# Altium schematic sheet 12-RTL8111H-3.schdoc
size A2
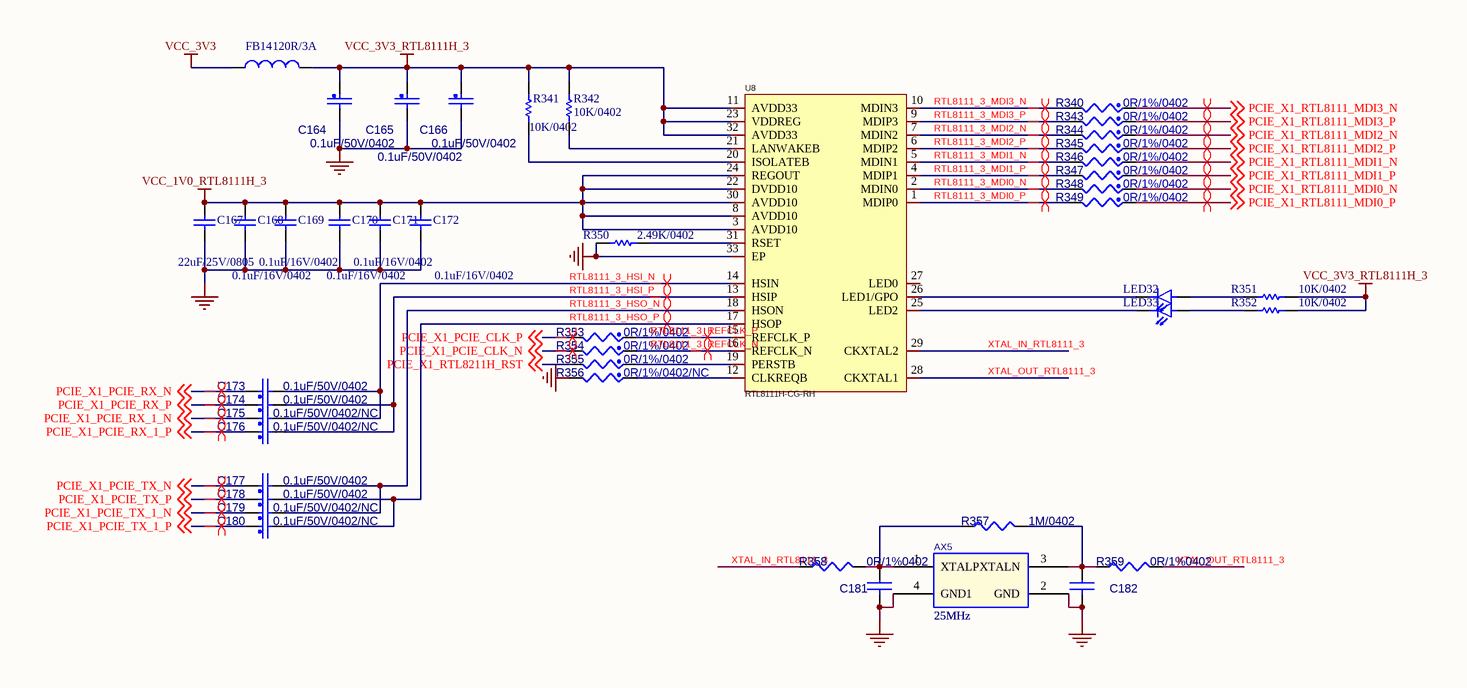
[diagram p0: 12-RTL8111H-3.schdoc]

## Parts
AX5  25MHz  [2016]
C164  value 0.1uF/50V/0402  [C0402]  (hidden comment: CAP_NP)
C165  value 0.1uF/50V/0402  [C0402]  (hidden comment: CAP_NP)
C166  value 0.1uF/50V/0402  [C0402]  (hidden comment: CAP_NP)
C167  22uF/25V/0805  [C0805]
C168  0.1uF/16V/0402  [C0402]
C169  0.1uF/16V/0402  [C0402]
C170  0.1uF/16V/0402  [C0402]
C171  0.1uF/16V/0402  [C0402]
C172  0.1uF/16V/0402  [C0402]
C173  value 0.1uF/50V/0402  [C0402]  (hidden comment: CAP_NP)
C174  value 0.1uF/50V/0402  [C0402]  (hidden comment: CAP_NP)
C175  value 0.1uF/50V/0402/NC  [C0402]  (hidden comment: CAP_NP)
C176  value 0.1uF/50V/0402/NC  [C0402]  (hidden comment: CAP_NP)
C177  value 0.1uF/50V/0402  [C0402]  (hidden comment: CAP_NP)
C178  value 0.1uF/50V/0402  [C0402]  (hidden comment: CAP_NP)
C179  value 0.1uF/50V/0402/NC  [C0402]  (hidden comment: CAP_NP)
C180  value 0.1uF/50V/0402/NC  [C0402]  (hidden comment: CAP_NP)
C181  CAP NP_Dup3  [C0402]  (value not drawn)
C182  CAP NP_Dup3  [C0402]  (value not drawn)
FB14  120R/3A  [L0603]
LED32  LED_GREEN  [LED0603]  (value not drawn)
LED33  LED_GREEN  [LED0603]  (value not drawn)
R340  value 0R/1%/0402  [R0402]  (hidden comment: RES_Dup2)
R341  10K/0402  [R0402]
R342  10K/0402  [R0402]
R343  value 0R/1%/0402  [R0402]  (hidden comment: RES_Dup2)
R344  value 0R/1%/0402  [R0402]  (hidden comment: RES_Dup2)
R345  value 0R/1%/0402  [R0402]  (hidden comment: RES_Dup2)
R346  value 0R/1%/0402  [R0402]  (hidden comment: RES_Dup2)
R347  value 0R/1%/0402  [R0402]  (hidden comment: RES_Dup2)
R348  value 0R/1%/0402  [R0402]  (hidden comment: RES_Dup2)
R349  value 0R/1%/0402  [R0402]  (hidden comment: RES_Dup2)
R350  2.49K/0402  [R0402]
R351  10K/0402  [R0402]
R352  10K/0402  [R0402]
R353  value 0R/1%/0402  [R0402]  (hidden comment: RES_Dup2)
R354  value 0R/1%/0402  [R0402]  (hidden comment: RES_Dup2)
R355  value 0R/1%/0402  [R0402]  (hidden comment: RES_Dup2)
R356  value 0R/1%/0402/NC  [R0402]  (hidden comment: RES_Dup2)
R357  value 1M/0402  [R0402]  (hidden comment: R_Dup3)
R358  value 0R/1%0402  [R0402]  (hidden comment: R_Dup3)
R359  value 0R/1%0402  [R0402]  (hidden comment: R_Dup3)
U8  RTL8111H-CG-RH  [RTL8111H-CG-RH]

## Nets
GND: AX5.2(GND) AX5.4(GND1) C164.2 C165.2 C166.2 C167.1 C168.1 C169.1 C170.1 C171.1 C172.1 C181.2 C182.2 R350.1 R356.2 U8.33(EP)
VCC_1V0_RTL8111H_3: C167.2 C168.2 C169.2 C170.2 C171.2 C172.2 U8.3(AVDD10) U8.8(AVDD10) U8.22(DVDD10) U8.24(REGOUT) U8.30(AVDD10)
VCC_3V3: FB14.1
VCC_3V3_RTL8111H_3: C164.1 C165.1 C166.1 FB14.2 R341.1 R342.1 R351.1 R352.1 U8.11(AVDD33) U8.23(VDDREG) U8.32(AVDD33)
PCIE_X1_PCIE_CLK_N: R354.2 ; off-sheet PCIE_X1_PCIE_CLK_N
PCIE_X1_PCIE_CLK_P: R353.2 ; off-sheet PCIE_X1_PCIE_CLK_P
PCIE_X1_PCIE_RX_1_N: C175.1 ; off-sheet PCIE_X1_PCIE_RX_1_N
PCIE_X1_PCIE_RX_1_P: C176.1 ; off-sheet PCIE_X1_PCIE_RX_1_P
PCIE_X1_PCIE_RX_N: C173.1 ; off-sheet PCIE_X1_PCIE_RX_N
PCIE_X1_PCIE_RX_P: C174.1 ; off-sheet PCIE_X1_PCIE_RX_P
PCIE_X1_PCIE_TX_1_N: C179.1 ; off-sheet PCIE_X1_PCIE_TX_1_N
PCIE_X1_PCIE_TX_1_P: C180.1 ; off-sheet PCIE_X1_PCIE_TX_1_P
PCIE_X1_PCIE_TX_N: C177.1 ; off-sheet PCIE_X1_PCIE_TX_N
PCIE_X1_PCIE_TX_P: C178.1 ; off-sheet PCIE_X1_PCIE_TX_P
PCIE_X1_RTL8111_MDI0_N: R348.1 ; off-sheet PCIE_X1_RTL8111_MDI0_N
PCIE_X1_RTL8111_MDI0_P: R349.1 ; off-sheet PCIE_X1_RTL8111_MDI0_P
PCIE_X1_RTL8111_MDI1_N: R346.1 ; off-sheet PCIE_X1_RTL8111_MDI1_N
PCIE_X1_RTL8111_MDI1_P: R347.1 ; off-sheet PCIE_X1_RTL8111_MDI1_P
PCIE_X1_RTL8111_MDI2_N: R344.1 ; off-sheet PCIE_X1_RTL8111_MDI2_N
PCIE_X1_RTL8111_MDI2_P: R345.1 ; off-sheet PCIE_X1_RTL8111_MDI2_P
PCIE_X1_RTL8111_MDI3_N: R340.1 ; off-sheet PCIE_X1_RTL8111_MDI3_N
PCIE_X1_RTL8111_MDI3_P: R343.1 ; off-sheet PCIE_X1_RTL8111_MDI3_P
PCIE_X1_RTL8211H_RST: R355.2 ; off-sheet PCIE_X1_RTL8211H_RST
RTL8111_3_HSI_N: C173.2 C175.2 U8.14(HSIN)
RTL8111_3_HSI_P: C174.2 C176.2 U8.13(HSIP)
RTL8111_3_HSO_N: C177.2 C179.2 U8.18(HSON)
RTL8111_3_HSO_P: C178.2 C180.2 U8.17(HSOP)
RTL8111_3_MDI0_N: R348.2 U8.2(MDIN0)
RTL8111_3_MDI0_P: R349.2 U8.1(MDIP0)
RTL8111_3_MDI1_N: R346.2 U8.5(MDIN1)
RTL8111_3_MDI1_P: R347.2 U8.4(MDIP1)
RTL8111_3_MDI2_N: R344.2 U8.7(MDIN2)
RTL8111_3_MDI2_P: R345.2 U8.6(MDIP2)
RTL8111_3_MDI3_N: R340.2 U8.10(MDIN3)
RTL8111_3_MDI3_P: R343.2 U8.9(MDIP3)
RTL8111_3_REFCLK_N: R354.1 U8.16(REFCLK_N)
RTL8111_3_REFCLK_P: R353.1 U8.15(REFCLK_P)
XTAL_IN_RTL8111_3: R358.1 U8.29(CKXTAL2)
XTAL_OUT_RTL8111_3: R359.2 U8.28(CKXTAL1)
NetAX5_1: AX5.1(XTALP) C181.1 R357.1 R358.2
NetAX5_3: AX5.3(XTALN) C182.1 R357.2 R359.1
NetLED32_1: LED32.1 R351.2
NetLED32_2: LED32.2 U8.26(LED1/GPO)
NetLED33_1: LED33.1 R352.2
NetLED33_2: LED33.2 U8.25(LED2)
NetR341_2: R341.2 U8.20(ISOLATEB)
NetR342_2: R342.2 U8.21(LANWAKEB)
NetR350_2: R350.2 U8.31(RSET)
NetR355_1: R355.1 U8.19(PERSTB)
NetR356_1: R356.1 U8.12(CLKREQB)

Not connected (* = marked no-connect by the designer): U8 27(LED0)

## Layout directives
differential pair: PCIE_X1_PCIE_CLK_N, PCIE_X1_PCIE_CLK_P, PCIE_X1_PCIE_RX_1_N, PCIE_X1_PCIE_RX_1_P, PCIE_X1_PCIE_RX_N, PCIE_X1_PCIE_RX_P, PCIE_X1_PCIE_TX_1_N, PCIE_X1_PCIE_TX_1_P, PCIE_X1_PCIE_TX_N, PCIE_X1_PCIE_TX_P, PCIE_X1_RTL8111_MDI0_N, PCIE_X1_RTL8111_MDI0_P, PCIE_X1_RTL8111_MDI1_N, PCIE_X1_RTL8111_MDI1_P, PCIE_X1_RTL8111_MDI2_N, PCIE_X1_RTL8111_MDI2_P, PCIE_X1_RTL8111_MDI3_N, PCIE_X1_RTL8111_MDI3_P, RTL8111_3_HSI_N, RTL8111_3_HSI_P, RTL8111_3_HSO_N, RTL8111_3_HSO_P, RTL8111_3_MDI0_N, RTL8111_3_MDI0_P, RTL8111_3_MDI1_N, RTL8111_3_MDI1_P, RTL8111_3_MDI2_N, RTL8111_3_MDI2_P, RTL8111_3_MDI3_N, RTL8111_3_MDI3_P, RTL8111_3_REFCLK_N, RTL8111_3_REFCLK_P

## Library data of the parts
AX5 = XTAL_0: Part Reference: AX3; PCB Footprint: CRY5032; Value: 25MHz
C164-C166 C173-C180 = CAP_NP: GCM155R71H104KE02/MURATA; Part Reference: C15; CLASS: DISCRETE; FPLIST: CC0402_25,CC0402_HD,CC0402_CC; CAD_APPROVED: Yes; MFG_PN01: 0402YC104KAT2A; MFG_NAME01: AVX; Tolerance: 10%; AGILE_PN: 150-75182; VOLTAGE: 16V; HEIGHT: 0.635MM; ROHS: Yes; TOL: 10%; PCB Footprint: C0402
C167-C172 = CAP: Capacitor; Value: 100pF; Published: 8-Jun-2000; Revision: July-2002: Re-released for DXP Platform.; Publisher: Altium Limited
C181 = CAP NP_Dup3: Part Reference: C71; Value: 20pF/50V X7R; PCB Footprint: C0402
C182 = CAP NP_Dup3: Part Reference: C72; Value: 20pF/50V X7R; PCB Footprint: C0402
FB14 = Inductor: BLM18KG121TN1D; Code_IEC: 1005; Value: 10mH; Published: 8-Jun-2000; LatestRevisionDate: 29-May-2009; LatestRevisionNote: IPC-7351 Footprint Added.; PackageReference: 0402-A; Publisher: Altium Limited; PackageDescription: Chip Inductor; Code_JEITA: 0402
LED32 LED33 = LED
R340 R353 = RES_Dup2: AC0402FR-070RL/YAGEO; Part Reference: R97; CLASS: DISCRETE; SIGNAL_MODEL: DEFAULT_RESISTOR_33.000000OHM_2_1; FPLIST: RC0603_OV; CAD_APPROVED: Yes; MFG_PN01: CR-02FL6---33R; MFG_NAME01: YAGEO; Tolerance: 1%; AGILE_PN: 470-75790; TOL: 5%; ROHS: Yes; HEIGHT: 0.4MM; PCB Footprint: R0402
R341 R342 R350 = Res Semi: Semiconductor Resistor; Value: 240R; Published: 8-Jun-2000; LatestRevisionDate: 17-Jul-2002; LatestRevisionNote: Re-released for DXP Platform.; PackageReference: AXIAL-0.5; Publisher: Altium Limited; PackageDescription: Axial Device, Thru-Hole; 2 Leads; 0.5 in Pin Spacing
R343 R354-R356 = RES_Dup2: AC0402FR-070RL/YAGEO; Part Reference: R98; CLASS: DISCRETE; TOL: 5%; AGILE_PN: 470-75790; Tolerance: 1%; MFG_NAME01: YAGEO; MFG_PN01: CR-02FL6---33R; CAD_APPROVED: Yes; FPLIST: RC0603_OV; SIGNAL_MODEL: DEFAULT_RESISTOR_33.000000OHM_2_1; HEIGHT: 0.4MM; ROHS: Yes; PCB Footprint: R0402
R344 = RES_Dup2: AC0402FR-070RL/YAGEO; Part Reference: R99; CLASS: DISCRETE; TOL: 5%; AGILE_PN: 470-75790; Tolerance: 1%; MFG_NAME01: YAGEO; MFG_PN01: CR-02FL6---33R; CAD_APPROVED: Yes; FPLIST: RC0603_OV; SIGNAL_MODEL: DEFAULT_RESISTOR_33.000000OHM_2_1; HEIGHT: 0.4MM; ROHS: Yes; PCB Footprint: R0402
R345 = RES_Dup2: AC0402FR-070RL/YAGEO; Part Reference: R101; CLASS: DISCRETE; TOL: 5%; AGILE_PN: 470-75790; Tolerance: 1%; MFG_NAME01: YAGEO; MFG_PN01: CR-02FL6---33R; CAD_APPROVED: Yes; FPLIST: RC0603_OV; SIGNAL_MODEL: DEFAULT_RESISTOR_33.000000OHM_2_1; HEIGHT: 0.4MM; ROHS: Yes; PCB Footprint: R0402
R346 = RES_Dup2: AC0402FR-070RL/YAGEO; Part Reference: R102; CLASS: DISCRETE; TOL: 5%; AGILE_PN: 470-75790; Tolerance: 1%; MFG_NAME01: YAGEO; MFG_PN01: CR-02FL6---33R; CAD_APPROVED: Yes; FPLIST: RC0603_OV; SIGNAL_MODEL: DEFAULT_RESISTOR_33.000000OHM_2_1; HEIGHT: 0.4MM; ROHS: Yes; PCB Footprint: R0402
R347 = RES_Dup2: AC0402FR-070RL/YAGEO; Part Reference: R103; CLASS: DISCRETE; TOL: 5%; AGILE_PN: 470-75790; Tolerance: 1%; MFG_NAME01: YAGEO; MFG_PN01: CR-02FL6---33R; CAD_APPROVED: Yes; FPLIST: RC0603_OV; SIGNAL_MODEL: DEFAULT_RESISTOR_33.000000OHM_2_1; HEIGHT: 0.4MM; ROHS: Yes; PCB Footprint: R0402
R348 = RES_Dup2: AC0402FR-070RL/YAGEO; Part Reference: R104; CLASS: DISCRETE; TOL: 5%; AGILE_PN: 470-75790; Tolerance: 1%; MFG_NAME01: YAGEO; MFG_PN01: CR-02FL6---33R; CAD_APPROVED: Yes; FPLIST: RC0603_OV; SIGNAL_MODEL: DEFAULT_RESISTOR_33.000000OHM_2_1; HEIGHT: 0.4MM; ROHS: Yes; PCB Footprint: R0402
R349 = RES_Dup2: AC0402FR-070RL/YAGEO; Part Reference: R105; CLASS: DISCRETE; TOL: 5%; AGILE_PN: 470-75790; Tolerance: 1%; MFG_NAME01: YAGEO; MFG_PN01: CR-02FL6---33R; CAD_APPROVED: Yes; FPLIST: RC0603_OV; SIGNAL_MODEL: DEFAULT_RESISTOR_33.000000OHM_2_1; HEIGHT: 0.4MM; ROHS: Yes; PCB Footprint: R0402
R351 R352 = Res Semi: Semiconductor Resistor; Value: 1K; Published: 8-Jun-2000; LatestRevisionDate: 17-Jul-2002; LatestRevisionNote: Re-released for DXP Platform.; PackageReference: AXIAL-0.5; Publisher: Altium Limited; PackageDescription: Axial Device, Thru-Hole; 2 Leads; 0.5 in Pin Spacing
R357 R358 = R_Dup3: Part Reference: R130; PCB Footprint: R0402
R359 = R_Dup3: Part Reference: R131; PCB Footprint: R0402
U8 = RTL8111H-CG: Manufacturer: REALTEK(瑞昱); Add into BOM: yes; Symbol: RTL8111H-CG; Device: RTL8111H-CG; LCSC Part Name: RTL8111H-CG; Supplier Part: C2761340; Manufacturer Part: RTL8111H-CG; Supplier Footprint: QFN-32-EP(4x4); JLCPCB Part Class: Extended Part; Datasheet: https://atta.szlcsc.com/upload/public/pdf/source/20210810/FF05C5D46F518898BC2EC053E52D54B5.pdf; Supplier: LCSC; Convert to PCB: yes; Comment_1: RTL8111H-CG